# Altium schematic sheet regulator module.SchDoc
size A
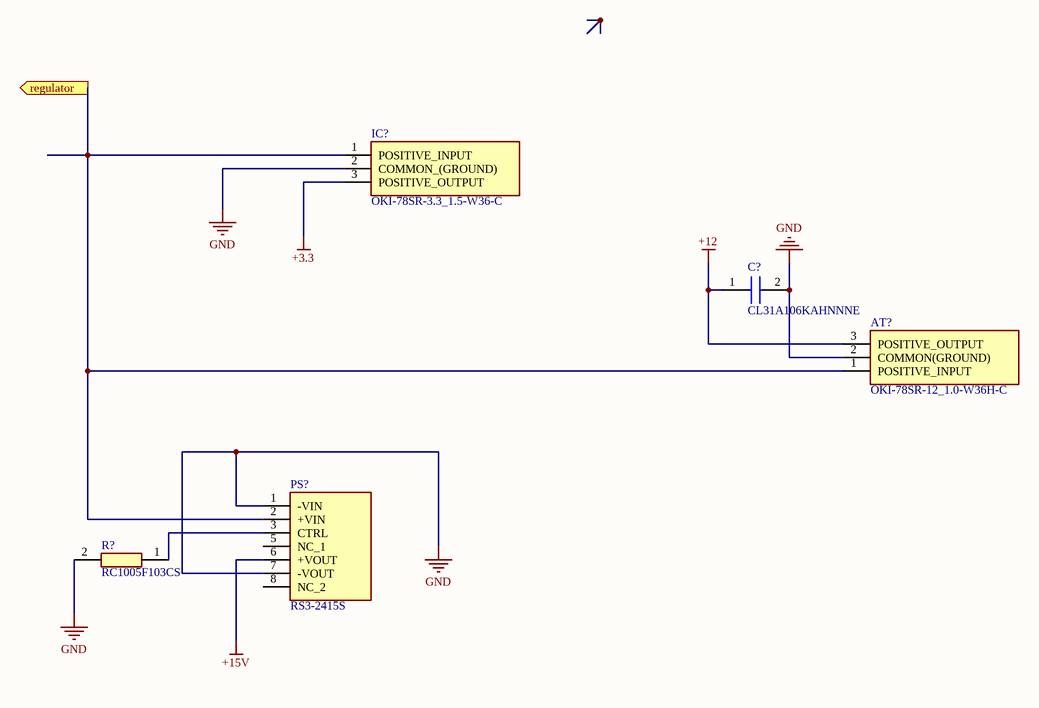
[diagram p0: regulator module.SchDoc]

## Parts
AT?  OKI-78SR-12_1.0-W36H-C  [OKI78SR1210W36HC]
C?  CL31A106KAHNNNE  [CAPC3216X180N]
IC?  OKI-78SR-3.3_1.5-W36-C  [OKI78SR3315W36C]
PS?  RS3-2415S  [RS32415S]
R?  RC1005F103CS  [RESC1005X40N]

## Ports
regulator (out)

## Nets
+3.3: IC?.3(POSITIVE_OUTPUT)
+12: AT?.3(POSITIVE_OUTPUT) C?.1
+15V: PS?.6(+VOUT)
GND: AT?.2(COMMON(GROUND)) C?.2 IC?.2(COMMON_(GROUND)) PS?.1(-VIN) PS?.7(-VOUT) R?.2
regulator: AT?.1(POSITIVE_INPUT) IC?.1(POSITIVE_INPUT) PS?.2(+VIN) ; port regulator
NetPS?_3: PS?.3(CTRL) R?.1

Not connected (* = marked no-connect by the designer): PS? 5(NC_1) 8(NC_2)

## Library data of the parts
AT? = OKI-78SR-12_1.0-W36H-C: Attenuator or Isolator; Manufacturer_Name: Murata Electronics; Manufacturer_Part_Number: OKI-78SR-12/1.0-W36H-C; Datasheet Link: https://power.murata.com/data/power/oki-78sr.pdf; Height: 8.6mm; Mouser Part Number: 580-OKI78SR12/1W36HC; Mouser Price/Stock: https://www.mouser.co.uk/ProductDetail/Murata-Power-Solutions/OKI-78SR-12-10-W36H-C?qs=AQlKX63v8Ru%252BZct7uNUrzA%3D%3D; Arrow Part Number: OKI-78SR-12/1.0-W36H-C; Arrow Price/Stock: https://www.arrow.com/en/products/oki-78sr-121.0-w36h-c/murata-power-solutions?region=nac
C? = CL31A106KAHNNNE: Capacitor; Manufacturer_Name: Samsung Electro-Mechanics; Datasheet Link: https://datasheet.datasheetarchive.com/originals/distributors/Datasheets_SAMA/8c86add0e95aa125c91e23e767429ce6.pdf; Height: 1.8mm; Manufacturer_Part_Number: CL31A106KAHNNNE; Mouser Part Number: 187-CL31A106KAHNNNE; Mouser Price/Stock: https://www.mouser.co.uk/ProductDetail/Samsung-Electro-Mechanics/CL31A106KAHNNNE?qs=349EhDEZ59rSHw4%2FqTnHBg%3D%3D; Arrow Part Number: CL31A106KAHNNNE; Arrow Price/Stock: https://www.arrow.com/en/products/cl31a106kahnnne/samsung-electro-mechanics?region=europe
IC? = OKI-78SR-3.3_1.5-W36-C: Integrated Circuit; Manufacturer_Name: Murata Electronics; Manufacturer_Part_Number: OKI-78SR-3.3/1.5-W36-C; Datasheet Link: https://power.murata.com/data/power/oki-78sr.pdf; Height: 16mm; Mouser Part Number: 580-OKI78SR3.31.536C; Mouser Price/Stock: https://www.mouser.co.uk/ProductDetail/Murata-Power-Solutions/OKI-78SR-33-15-W36-C?qs=uJpRT2lXVNX73zEQlCgxZA%3D%3D; Arrow Part Number: OKI-78SR-3.3/1.5-W36-C; Arrow Price/Stock: https://www.arrow.com/en/products/oki-78sr-3.31.5-w36-c/murata-power-solutions?region=nac
PS? = RS3-2415S: Power Supply; Manufacturer_Name: RECOM Power; Datasheet Link: https://www.recom-power.com/pdf/Econoline/RS3-S_D_Z.pdf; Height: 11.35mm; Manufacturer_Part_Number: RS3-2415S; Mouser Part Number: 919-RS3-2415S; Mouser Price/Stock: https://www.mouser.com/Search/Refine.aspx?Keyword=919-RS3-2415S
R? = RC1005F103CS: Resistor; Manufacturer_Name: Samsung Electro-Mechanics; Datasheet Link: https://datasheet.datasheetarchive.com/originals/distributors/Datasheets-DGA22/1466507.pdf; Height: 0.4mm; Manufacturer_Part_Number: RC1005F103CS; Mouser Part Number: N/A; Mouser Price/Stock: https://www.mouser.com/Search/Refine.aspx?Keyword=N%2FA; Arrow Part Number: RC1005F103CS; Arrow Price/Stock: https://www.arrow.com/en/products/rc1005f103cs/samsung-electro-mechanics